# Altium schematic sheet PI_R3_REV1_MAIN.SchDoc
size 500 x 500 mm
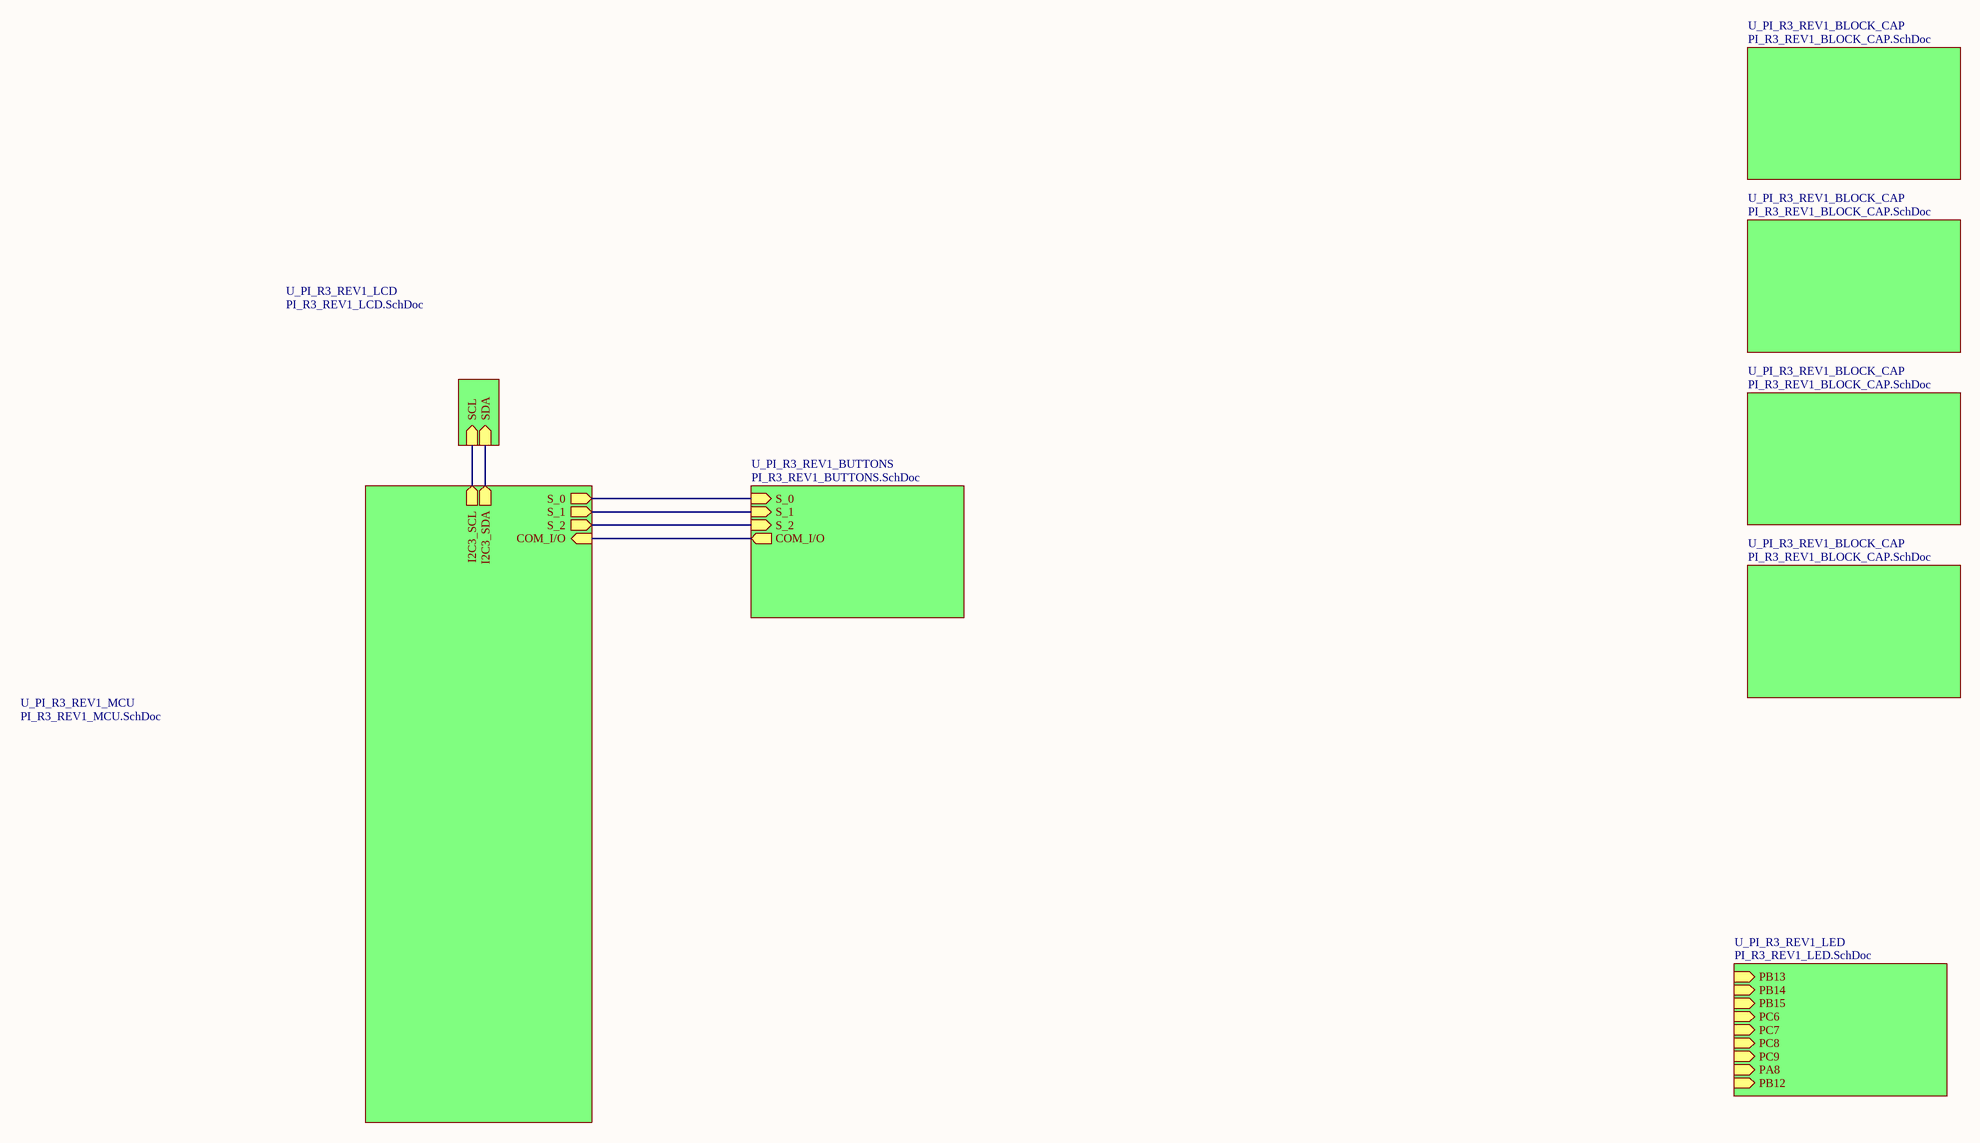
[diagram p0: PI_R3_REV1_MAIN.SchDoc]

## Sub-sheets
U_PI_R3_REV1_BLOCK_CAP = PI_R3_REV1_BLOCK_CAP.SchDoc: no entries
U_PI_R3_REV1_BLOCK_CAP = PI_R3_REV1_BLOCK_CAP.SchDoc: no entries
U_PI_R3_REV1_BLOCK_CAP = PI_R3_REV1_BLOCK_CAP.SchDoc: no entries
U_PI_R3_REV1_BLOCK_CAP = PI_R3_REV1_BLOCK_CAP.SchDoc: no entries
U_PI_R3_REV1_BUTTONS = PI_R3_REV1_BUTTONS.SchDoc: S_1 (in), S_2 (in), S_0 (in), COM_I/O (out)
U_PI_R3_REV1_LCD = PI_R3_REV1_LCD.SchDoc: SCL (in), SDA (in)
U_PI_R3_REV1_LED = PI_R3_REV1_LED.SchDoc: PB13 (in), PB14 (in), PB15 (in), PC6 (in), PC7 (in), PC8 (in), PC9 (in), PA8 (in), PB12 (in)
U_PI_R3_REV1_MCU = PI_R3_REV1_MCU.SchDoc: COM_I/O (in), S_1 (out), S_0 (out), S_2 (out), I2C3_SCL (out), I2C3_SDA (out)

## Nets
(unnamed): sheet U_PI_R3_REV1_MCU/COM_I/O, sheet U_PI_R3_REV1_BUTTONS/COM_I/O
(unnamed): sheet U_PI_R3_REV1_MCU/S_1, sheet U_PI_R3_REV1_BUTTONS/S_1
(unnamed): sheet U_PI_R3_REV1_MCU/S_0, sheet U_PI_R3_REV1_BUTTONS/S_0
(unnamed): sheet U_PI_R3_REV1_MCU/S_2, sheet U_PI_R3_REV1_BUTTONS/S_2
(unnamed): sheet U_PI_R3_REV1_MCU/I2C3_SCL, sheet U_PI_R3_REV1_LCD/SCL
(unnamed): sheet U_PI_R3_REV1_MCU/I2C3_SDA, sheet U_PI_R3_REV1_LCD/SDA